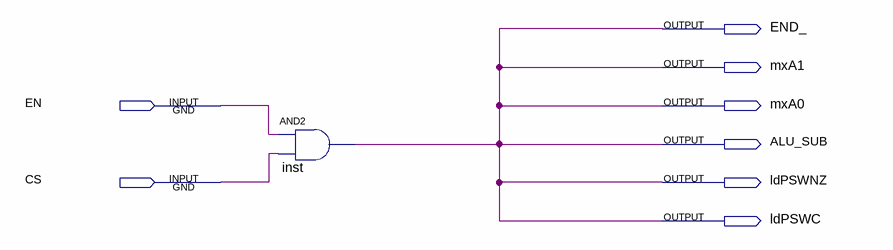
[diagram p0: schematic sheet]
// Quartus schematic CPY.bdf as structural Verilog: 1 symbols, 8 pins
module CPY (
  input  EN,
  input  CS,
  output END_,
  output mxA1,
  output mxA0,
  output ALU_SUB,
  output ldPSWNZ,
  output ldPSWC
);

  and inst (ALU_SUB, EN, CS);

  assign END_ = ALU_SUB;
  assign ldPSWC = ALU_SUB;
  assign ldPSWNZ = ALU_SUB;
  assign mxA0 = ALU_SUB;
  assign mxA1 = ALU_SUB;
endmodule
